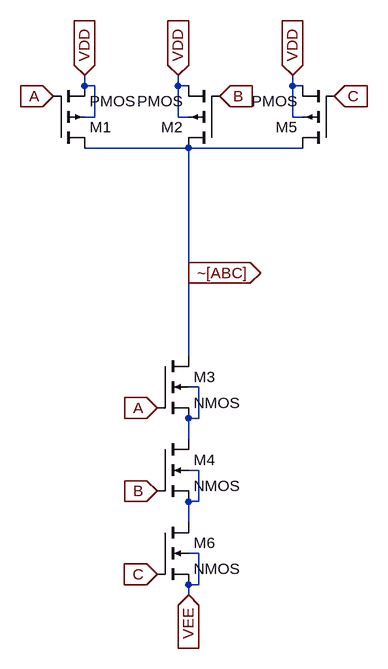
[diagram p0: schematic 3_Input_NAND_Gate_Symbol.asc]
3_Input_NAND_Gate_Symbol.asc, the LTspice schematic file:
Version 4
SHEET 1 880 920
WIRE 256 48 256 32
WIRE 272 48 256 48
WIRE 400 48 400 32
WIRE 416 48 400 48
WIRE 576 48 576 32
WIRE 592 48 576 48
WIRE 272 96 272 48
WIRE 272 96 256 96
WIRE 400 96 400 48
WIRE 416 96 400 96
WIRE 576 96 576 48
WIRE 592 96 576 96
WIRE 416 144 256 144
WIRE 592 144 416 144
WIRE 416 336 416 144
WIRE 416 464 416 336
WIRE 432 512 416 512
WIRE 432 560 432 512
WIRE 432 560 416 560
WIRE 416 592 416 560
WIRE 432 640 416 640
WIRE 432 688 432 640
WIRE 432 688 416 688
WIRE 416 720 416 688
WIRE 432 768 416 768
WIRE 432 816 432 768
WIRE 432 816 416 816
WIRE 416 832 416 816
FLAG 208 64 A
IOPIN 208 64 In
FLAG 368 544 A
IOPIN 368 544 In
FLAG 464 64 B
IOPIN 464 64 In
FLAG 368 672 B
IOPIN 368 672 In
FLAG 256 32 VDD
IOPIN 256 32 In
FLAG 400 32 VDD
IOPIN 400 32 In
FLAG 416 832 VEE
IOPIN 416 832 In
FLAG 640 64 C
IOPIN 640 64 In
FLAG 576 32 VDD
IOPIN 576 32 In
FLAG 368 800 C
IOPIN 368 800 In
FLAG 416 336 ~[ABC]
IOPIN 416 336 Out
SYMBOL pmos4 208 144 M180
SYMATTR InstName M1
SYMBOL pmos4 464 144 R180
SYMATTR InstName M2
SYMBOL nmos4 368 464 R0
SYMATTR InstName M3
SYMBOL nmos4 368 592 R0
SYMATTR InstName M4
SYMBOL pmos4 640 144 R180
SYMATTR InstName M5
SYMBOL nmos4 368 720 R0
SYMATTR InstName M6

The netlist it stands for:
* 3_Input_NAND_Gate_Symbol.asc
M1 ~[ABC] A VDD VDD PMOS
M2 ~[ABC] B VDD VDD PMOS
M3 ~[ABC] A N001 N001 NMOS
M4 N001 B N002 N002 NMOS
M5 ~[ABC] C VDD VDD PMOS
M6 N002 C VEE VEE NMOS
.model NMOS NMOS
.model PMOS PMOS
.lib standard.mos
.backanno
.end